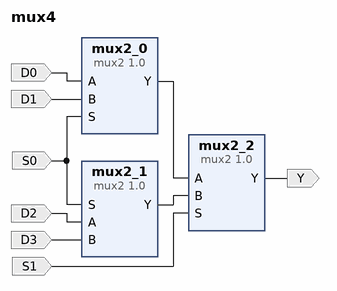
[diagram p0: block diagram of the top level]
# Vivado block design mux4, xc7z020clg484-2, Vivado 2024.1
create_bd_design mux4

create_bd_port -dir I S0
create_bd_port -dir O Y
create_bd_port -dir I S1
create_bd_port -dir I D0
create_bd_port -dir I D1
create_bd_port -dir I D2
create_bd_port -dir I D3

create_bd_cell -type ip -vlnv xilinx.com:user:mux2:1.0 mux2_0
create_bd_cell -type ip -vlnv xilinx.com:user:mux2:1.0 mux2_1
create_bd_cell -type ip -vlnv xilinx.com:user:mux2:1.0 mux2_2

# ---- connections ----

connect_bd_net -net a_0_1 [get_bd_ports D0] [get_bd_pins mux2_0/A]
connect_bd_net -net a_1_1 [get_bd_ports D2] [get_bd_pins mux2_1/A]
connect_bd_net -net b_0_1 [get_bd_ports D1] [get_bd_pins mux2_0/B]
connect_bd_net -net b_1_1 [get_bd_ports D3] [get_bd_pins mux2_1/B]
connect_bd_net -net mux2_0_out [get_bd_pins mux2_0/Y] [get_bd_pins mux2_2/A]
connect_bd_net -net mux2_1_out [get_bd_pins mux2_1/Y] [get_bd_pins mux2_2/B]
connect_bd_net -net mux2_2_out [get_bd_pins mux2_2/Y] [get_bd_ports Y]
connect_bd_net -net sl_0_1 [get_bd_ports S0] [get_bd_pins mux2_0/S] [get_bd_pins mux2_1/S]
connect_bd_net -net sl_1_1 [get_bd_ports S1] [get_bd_pins mux2_2/S]

validate_bd_design
save_bd_design
